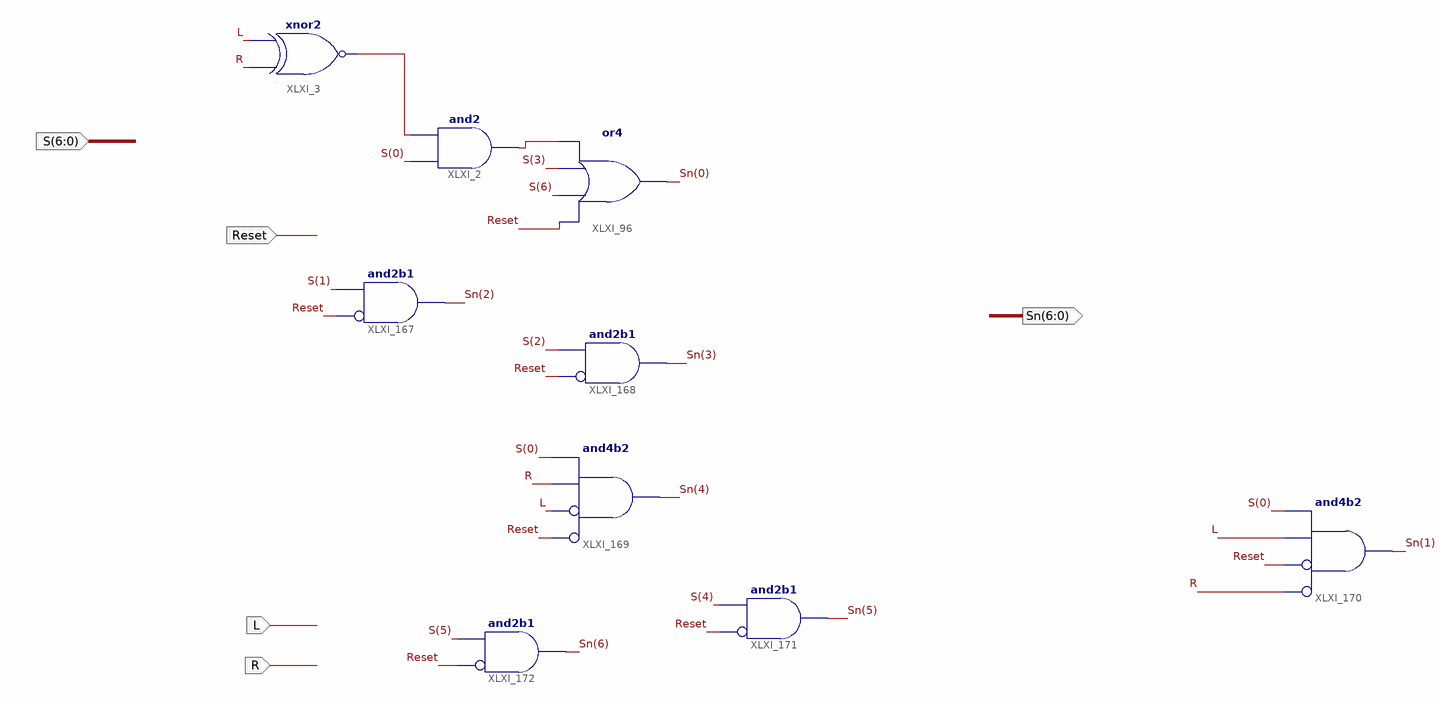
[diagram p0: schematic sheet 1]
// Xilinx ISE schematic nso_dwe.sch (spartan3) as structural Verilog: 9 symbols, 5 ports
module nso_dwe (
  input  L,
  input  R,
  input  Reset,
  input  [6:0] S,
  output [6:0] Sn
);

  wire XLXN_18, XLXN_19;

  and XLXI_2 (XLXN_18, S[0], XLXN_19);
  xnor XLXI_3 (XLXN_19, R, L);
  or XLXI_96 (Sn[0], Reset, S[6], S[3], XLXN_18);
  and XLXI_167 (Sn[2], ~Reset, S[1]);  // and2b1
  and XLXI_168 (Sn[3], ~Reset, S[2]);  // and2b1
  and XLXI_169 (Sn[4], ~Reset, ~L, R, S[0]);  // and4b2
  and XLXI_170 (Sn[1], ~R, ~Reset, L, S[0]);  // and4b2
  and XLXI_171 (Sn[5], ~Reset, S[4]);  // and2b1
  and XLXI_172 (Sn[6], ~Reset, S[5]);  // and2b1
endmodule
